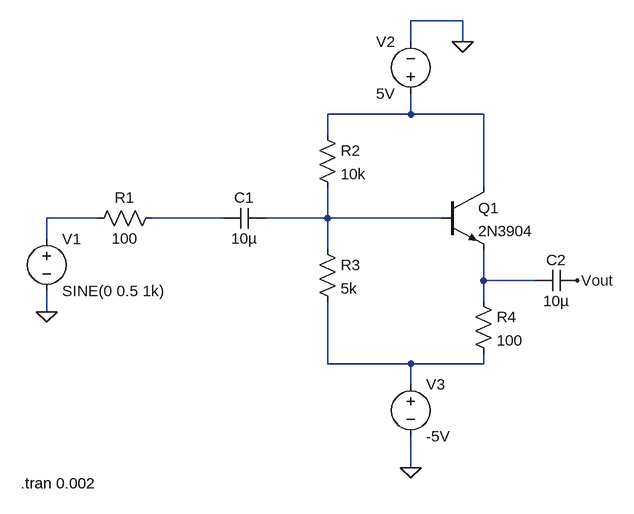
[diagram p0: schematic Project 3.asc]
Project 3.asc, the LTspice schematic file:
Version 4
SHEET 1 952 680
WIRE 704 -224 624 -224
WIRE 624 -192 624 -224
WIRE 704 -192 704 -224
WIRE 624 -80 624 -112
WIRE 624 -80 496 -80
WIRE 736 -80 624 -80
WIRE 496 -48 496 -80
WIRE 736 32 736 -80
WIRE 144 80 64 80
WIRE 336 80 224 80
WIRE 496 80 496 32
WIRE 496 80 400 80
WIRE 672 80 496 80
WIRE 64 112 64 80
WIRE 496 128 496 80
WIRE 736 176 736 128
WIRE 816 176 736 176
WIRE 736 208 736 176
WIRE 64 224 64 192
WIRE 496 304 496 208
WIRE 624 304 496 304
WIRE 736 304 736 288
WIRE 736 304 624 304
WIRE 624 336 624 304
WIRE 624 464 624 416
FLAG 704 -192 0
FLAG 624 464 0
FLAG 64 224 0
FLAG 880 176 Vout
SYMBOL voltage 64 96 R0
WINDOW 123 0 0 Left 0
WINDOW 39 0 0 Left 0
SYMATTR InstName V1
SYMATTR Value SINE(0 0.5 1k)
SYMBOL res 240 64 R90
WINDOW 0 0 56 VBottom 2
WINDOW 3 32 56 VTop 2
SYMATTR InstName R1
SYMATTR Value 100
SYMBOL cap 400 64 R90
WINDOW 0 0 32 VBottom 2
WINDOW 3 32 32 VTop 2
SYMATTR InstName C1
SYMATTR Value 10µ
SYMBOL res 480 -64 R0
SYMATTR InstName R2
SYMATTR Value 10k
SYMBOL res 480 112 R0
SYMATTR InstName R3
SYMATTR Value 5k
SYMBOL voltage 624 -96 R180
WINDOW 0 24 96 Left 2
WINDOW 3 24 16 Left 2
SYMATTR InstName V2
SYMATTR Value 5V
SYMBOL npn 672 32 R0
SYMATTR InstName Q1
SYMATTR Value 2N3904
SYMBOL res 720 192 R0
SYMATTR InstName R4
SYMATTR Value 100
SYMBOL voltage 624 320 R0
SYMATTR InstName V3
SYMATTR Value -5V
SYMBOL cap 880 160 R90
WINDOW 0 0 32 VBottom 2
WINDOW 3 32 32 VTop 2
SYMATTR InstName C2
SYMATTR Value 10µ
TEXT 24 488 Left 2 !.tran 0.002

The netlist it stands for:
* Project 3.asc
V1 N002 0 SINE(0 0.5 1k)
R1 N003 N002 100
C1 N004 N003 10µ
R2 N001 N004 10k
R3 N004 N006 5k
V2 N001 0 5V
Q1 N001 N004 N005 0 2N3904
R4 N005 N006 100
V3 N006 0 -5V
C2 Vout N005 10µ
.model NPN NPN
.model PNP PNP
.lib standard.bjt
.tran 0.002
.backanno
.end